# Altium project Spinn5Power.PrjPcb
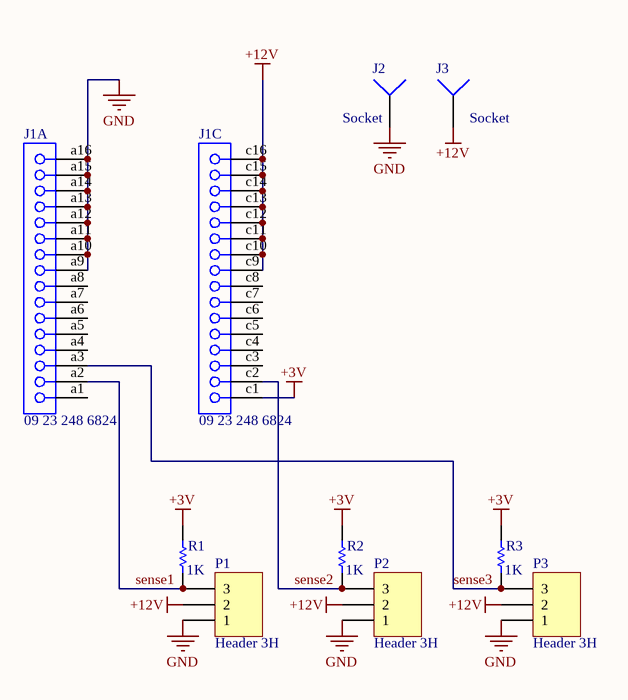
[diagram p0: Spinn5Power.SchDoc]
1 sheet, 9 parts. Net scope: global (net labels, ports and power ports of the same name join across sheets).
Board files: Spinn5Power.PcbDoc, Spinn5Power_Panel.PcbDoc

## Sheet Spinn5Power.SchDoc
size A4

### Parts
J1  09 23 248 6824  [0923248x824]  (parts A,C of 4)
J2  Socket  [PIN1]
J3  Socket  [PIN1]
P1  Header 3H  [HDR1X3H]
P2  Header 3H  [HDR1X3H]
P3  Header 3H  [HDR1X3H]
R1  value 1K  [AXIAL-0.3]  (hidden comment: Res1)
R2  value 1K  [AXIAL-0.3]  (hidden comment: Res1)
R3  value 1K  [AXIAL-0.3]  (hidden comment: Res1)

### Nets
+3V: J1.c1 R1.2 R2.2 R3.2
+12V: J1.c9 J1.c10 J1.c11 J1.c12 J1.c13 J1.c14 J1.c15 J1.c16 J3.1 P1.2 P2.2 P3.2
GND: J1.a9 J1.a10 J1.a11 J1.a12 J1.a13 J1.a14 J1.a15 J1.a16 J2.1 P1.1 P2.1 P3.1
sense1: J1.a2 P1.3 R1.1
sense2: J1.c2 P2.3 R2.1
sense3: J1.a3 P3.3 R3.1

Not connected (* = marked no-connect by the designer): J1 a1 a4 a5 a6 a7 a8 c3 c4 c5 c6 c7 c8

### Library data of the parts
J1 = 09 23 248 6824: Eurocard DIN 41612, Type 2C, Half Size, 48 Position, Rows a+b+c, Performance level 2, Female, Lead 2.9 mm, Pitch 2.54 mm; DrillSize: Corresponds to nominal value.; Published: 6-Oct-2005; DatasheetDocument: 02-Jun-2003; PackageDocument: 08-Feb-2002; PackageReference: 0923248x824; Publisher: Altium Limited; ComponentLink1Description: Manufacturer Link; ComponentLink1URL: http://www.harting.com/; ComponentLink2Description: Packaging Specification; ComponentLink2URL: http://www.harkis.harting.com/_gds/pdf/TB_0923248x824_BL01_R30232.pdf
P1-P3 = Header 3H: Header, 3-Pin, Right Angle; LatestRevisionDate: 17-Jul-2002; LatestRevisionNote: Re-released for DXP Platform.; Publisher: Altium Limited
R1-R3 = Res1: Resistor; Published: 8-Jun-2000; LatestRevisionDate: 17-Jul-2002; LatestRevisionNote: Re-released for DXP Platform.; PackageReference: AXIAL-0.3; Publisher: Altium Limited; PackageDescription: Axial Device, Thru-Hole; 2 Leads; 0.3 in Pin Spacing
J2 J3 = Socket: LatestRevisionDate: 17-Jul-2002; LatestRevisionNote: Re-released for DXP Platform.; Publisher: Altium Limited